# Altium schematic sheet Customer_Module-Main_Connector.SchDoc
size A4
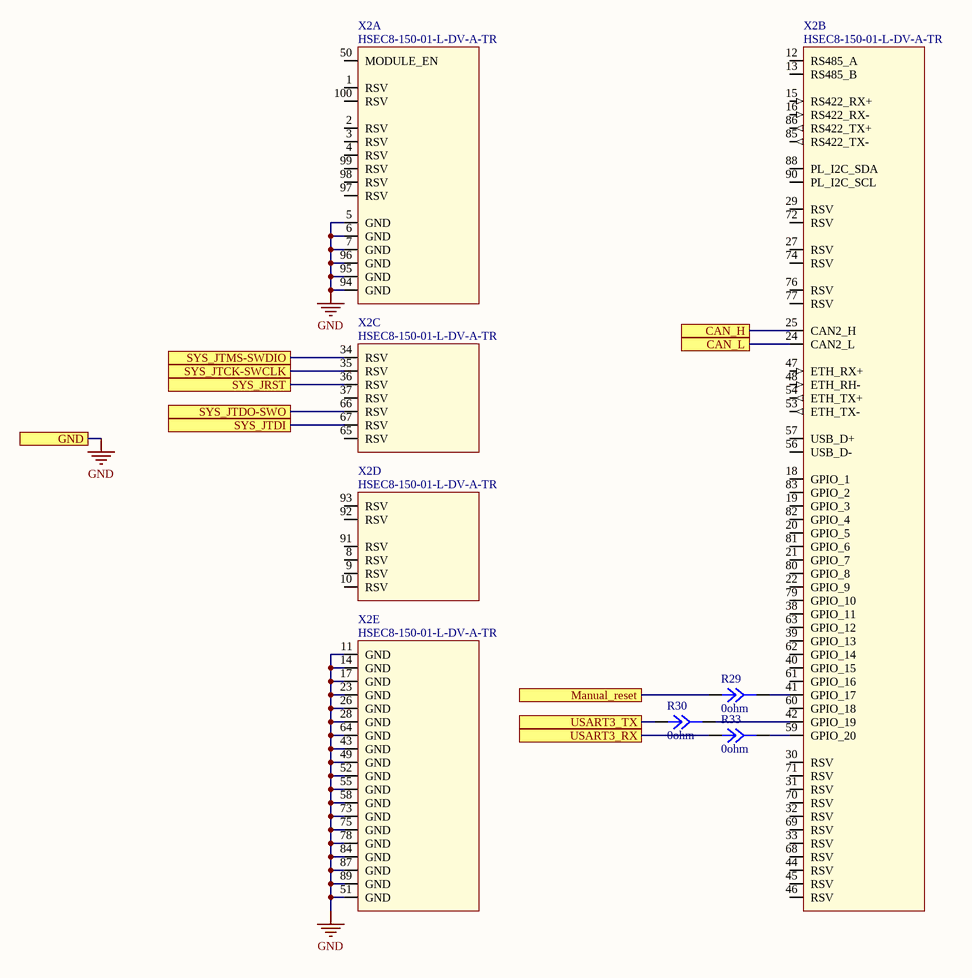
[diagram p0: Customer_Module-Main_Connector.SchDoc]

## Parts
R29  0ohm  [Jumper 2]
R30  0ohm  [Jumper 2]
R33  0ohm  [Jumper 2]
X2  HSEC8-150-01-L-DV-A-TR  [HSEC8-150-01-L-DV-A-TR]  (parts A,B,C,D,E of 5)

## Ports
CAN_H, CAN_L, GND, Manual_reset, SYS_JRST, SYS_JTCK-SWCLK, SYS_JTDI, SYS_JTDO-SWO, SYS_JTMS-SWDIO, USART3_RX, USART3_TX

## Nets
GND: X2.5(GND) X2.6(GND) X2.7(GND) X2.11(GND) X2.14(GND) X2.17(GND) X2.23(GND) X2.26(GND) X2.28(GND) X2.43(GND) X2.49(GND) X2.51(GND) X2.52(GND) X2.55(GND) X2.58(GND) X2.64(GND) X2.73(GND) X2.75(GND) X2.78(GND) X2.84(GND) X2.87(GND) X2.89(GND) X2.94(GND) X2.95(GND) X2.96(GND) ; port GND
CAN_H: X2.25(CAN2_H) ; port CAN_H
CAN_L: X2.24(CAN2_L) ; port CAN_L
Manual_reset: R29.1 ; port Manual_reset
SYS_JRST: X2.36(RSV) ; port SYS_JRST
SYS_JTCK-SWCLK: X2.35(RSV) ; port SYS_JTCK-SWCLK
SYS_JTDI: X2.67(RSV) ; port SYS_JTDI
SYS_JTDO-SWO: X2.66(RSV) ; port SYS_JTDO-SWO
SYS_JTMS-SWDIO: X2.34(RSV) ; port SYS_JTMS-SWDIO
USART3_RX: R33.1 ; port USART3_RX
USART3_TX: R30.1 ; port USART3_TX
NetR29_2: R29.2 X2.41(GPIO_17)
NetR30_2: R30.2 X2.42(GPIO_19)
NetR33_2: R33.2 X2.59(GPIO_20)

Not connected (* = marked no-connect by the designer): X2 1(RSV) 2(RSV) 3(RSV) 4(RSV) 8(RSV) 9(RSV) 10(RSV) 12(RS485_A) 13(RS485_B) 15(RS422_RX+) 16(RS422_RX-) 18(GPIO_1) 19(GPIO_3) 20(GPIO_5) 21(GPIO_7) 22(GPIO_9) 27(RSV) 29(RSV) 30(RSV) 31(RSV) 32(RSV) 33(RSV) 37(RSV) 38(GPIO_11) 39(GPIO_13) 40(GPIO_15) 44(RSV) 45(RSV) 46(RSV) 47(ETH_RX+) 48(ETH_RH-) 50(MODULE_EN) 53(ETH_TX-) 54(ETH_TX+) 56(USB_D-) 57(USB_D+) 60(GPIO_18) 61(GPIO_16) 62(GPIO_14) 63(GPIO_12) 65(RSV) 68(RSV) 69(RSV) 70(RSV) 71(RSV) 72(RSV) 74(RSV) 76(RSV) 77(RSV) 79(GPIO_10) 80(GPIO_8) 81(GPIO_6) 82(GPIO_4) 83(GPIO_2) 85(RS422_TX-) 86(RS422_TX+) 88(PL_I2C_SDA) 90(PL_I2C_SCL) 91(RSV) 92(RSV) 93(RSV) 97(RSV) 98(RSV) 99(RSV) 100(RSV)

## Library data of the parts
R29 R30 R33 = Mini jumper